# EAGLE schematic main (EAGLE 8.2.0)
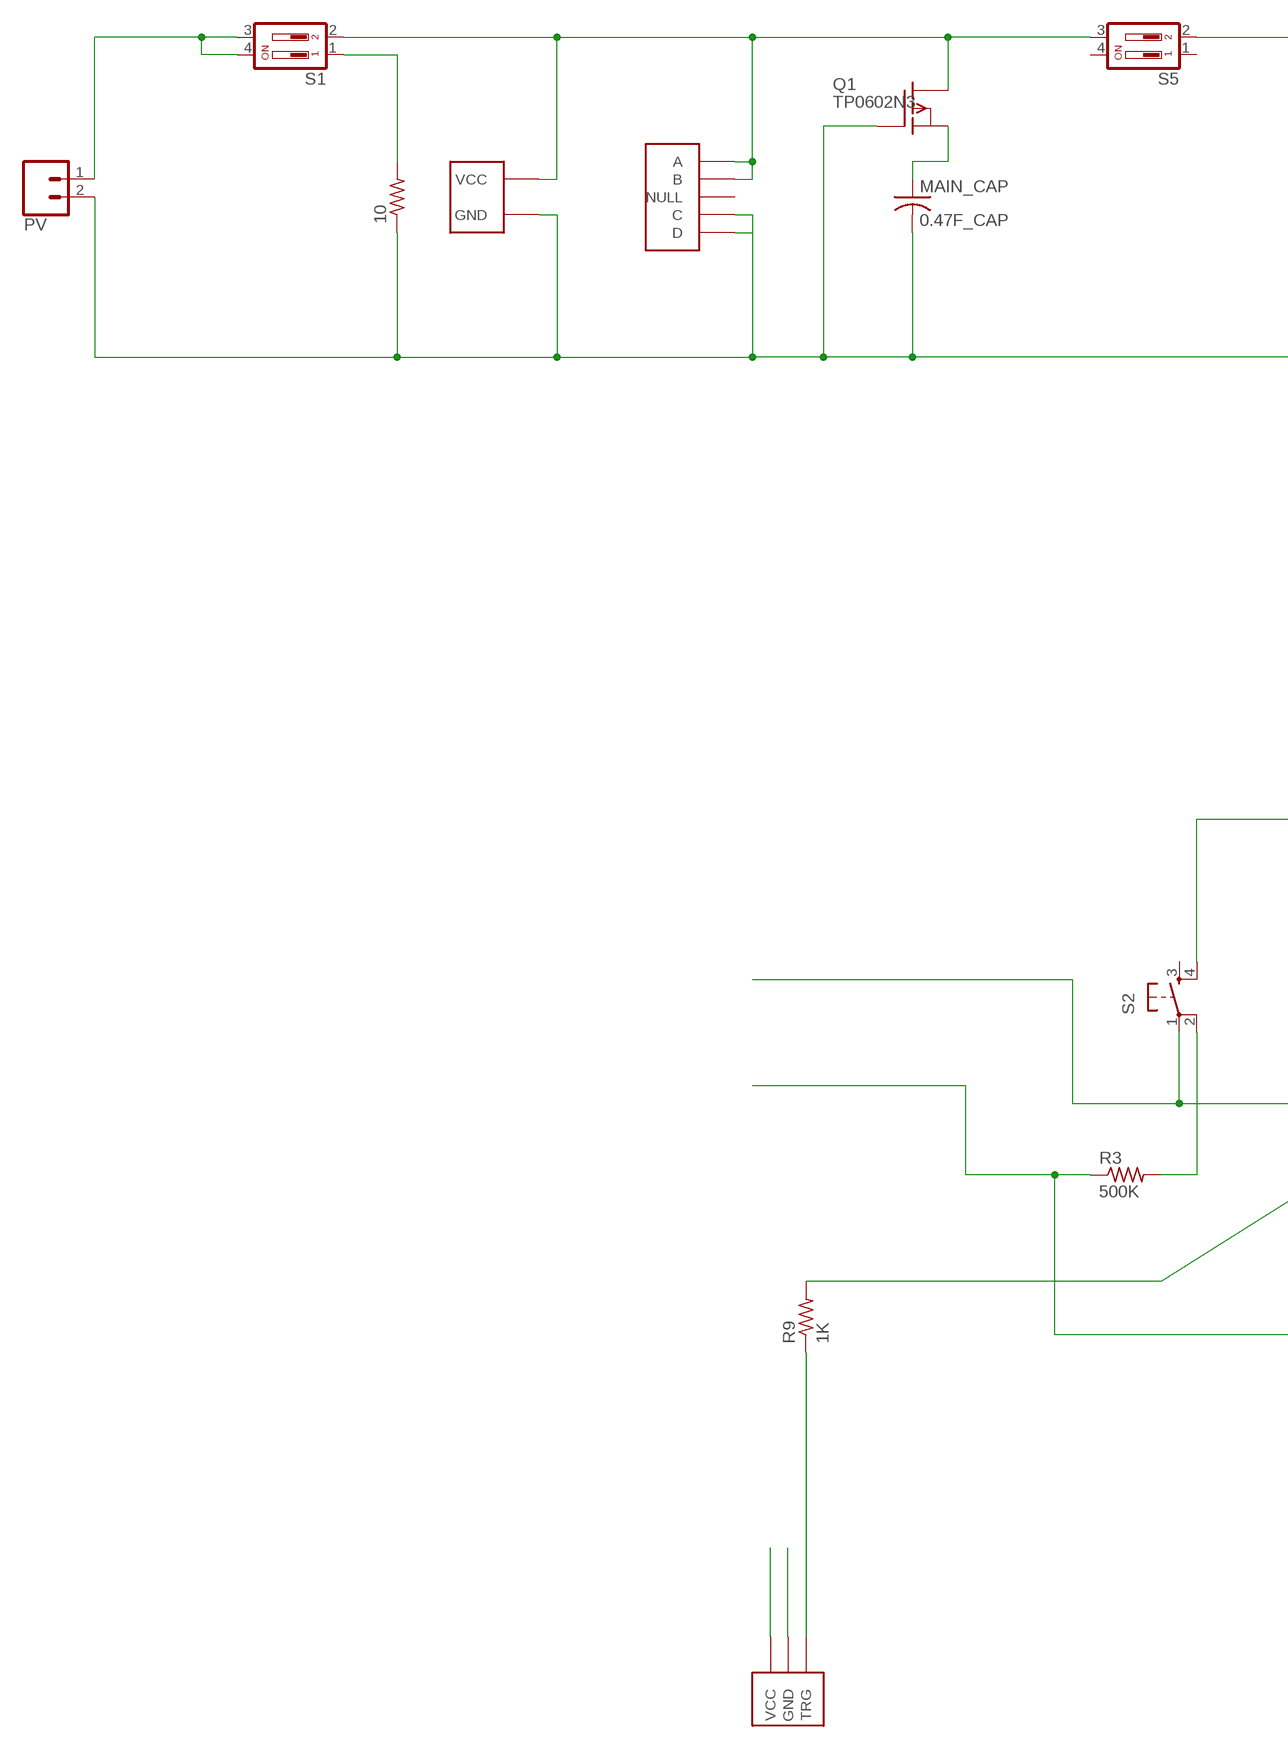
[diagram p0: schematic, sheet 1, part 1 of 2]
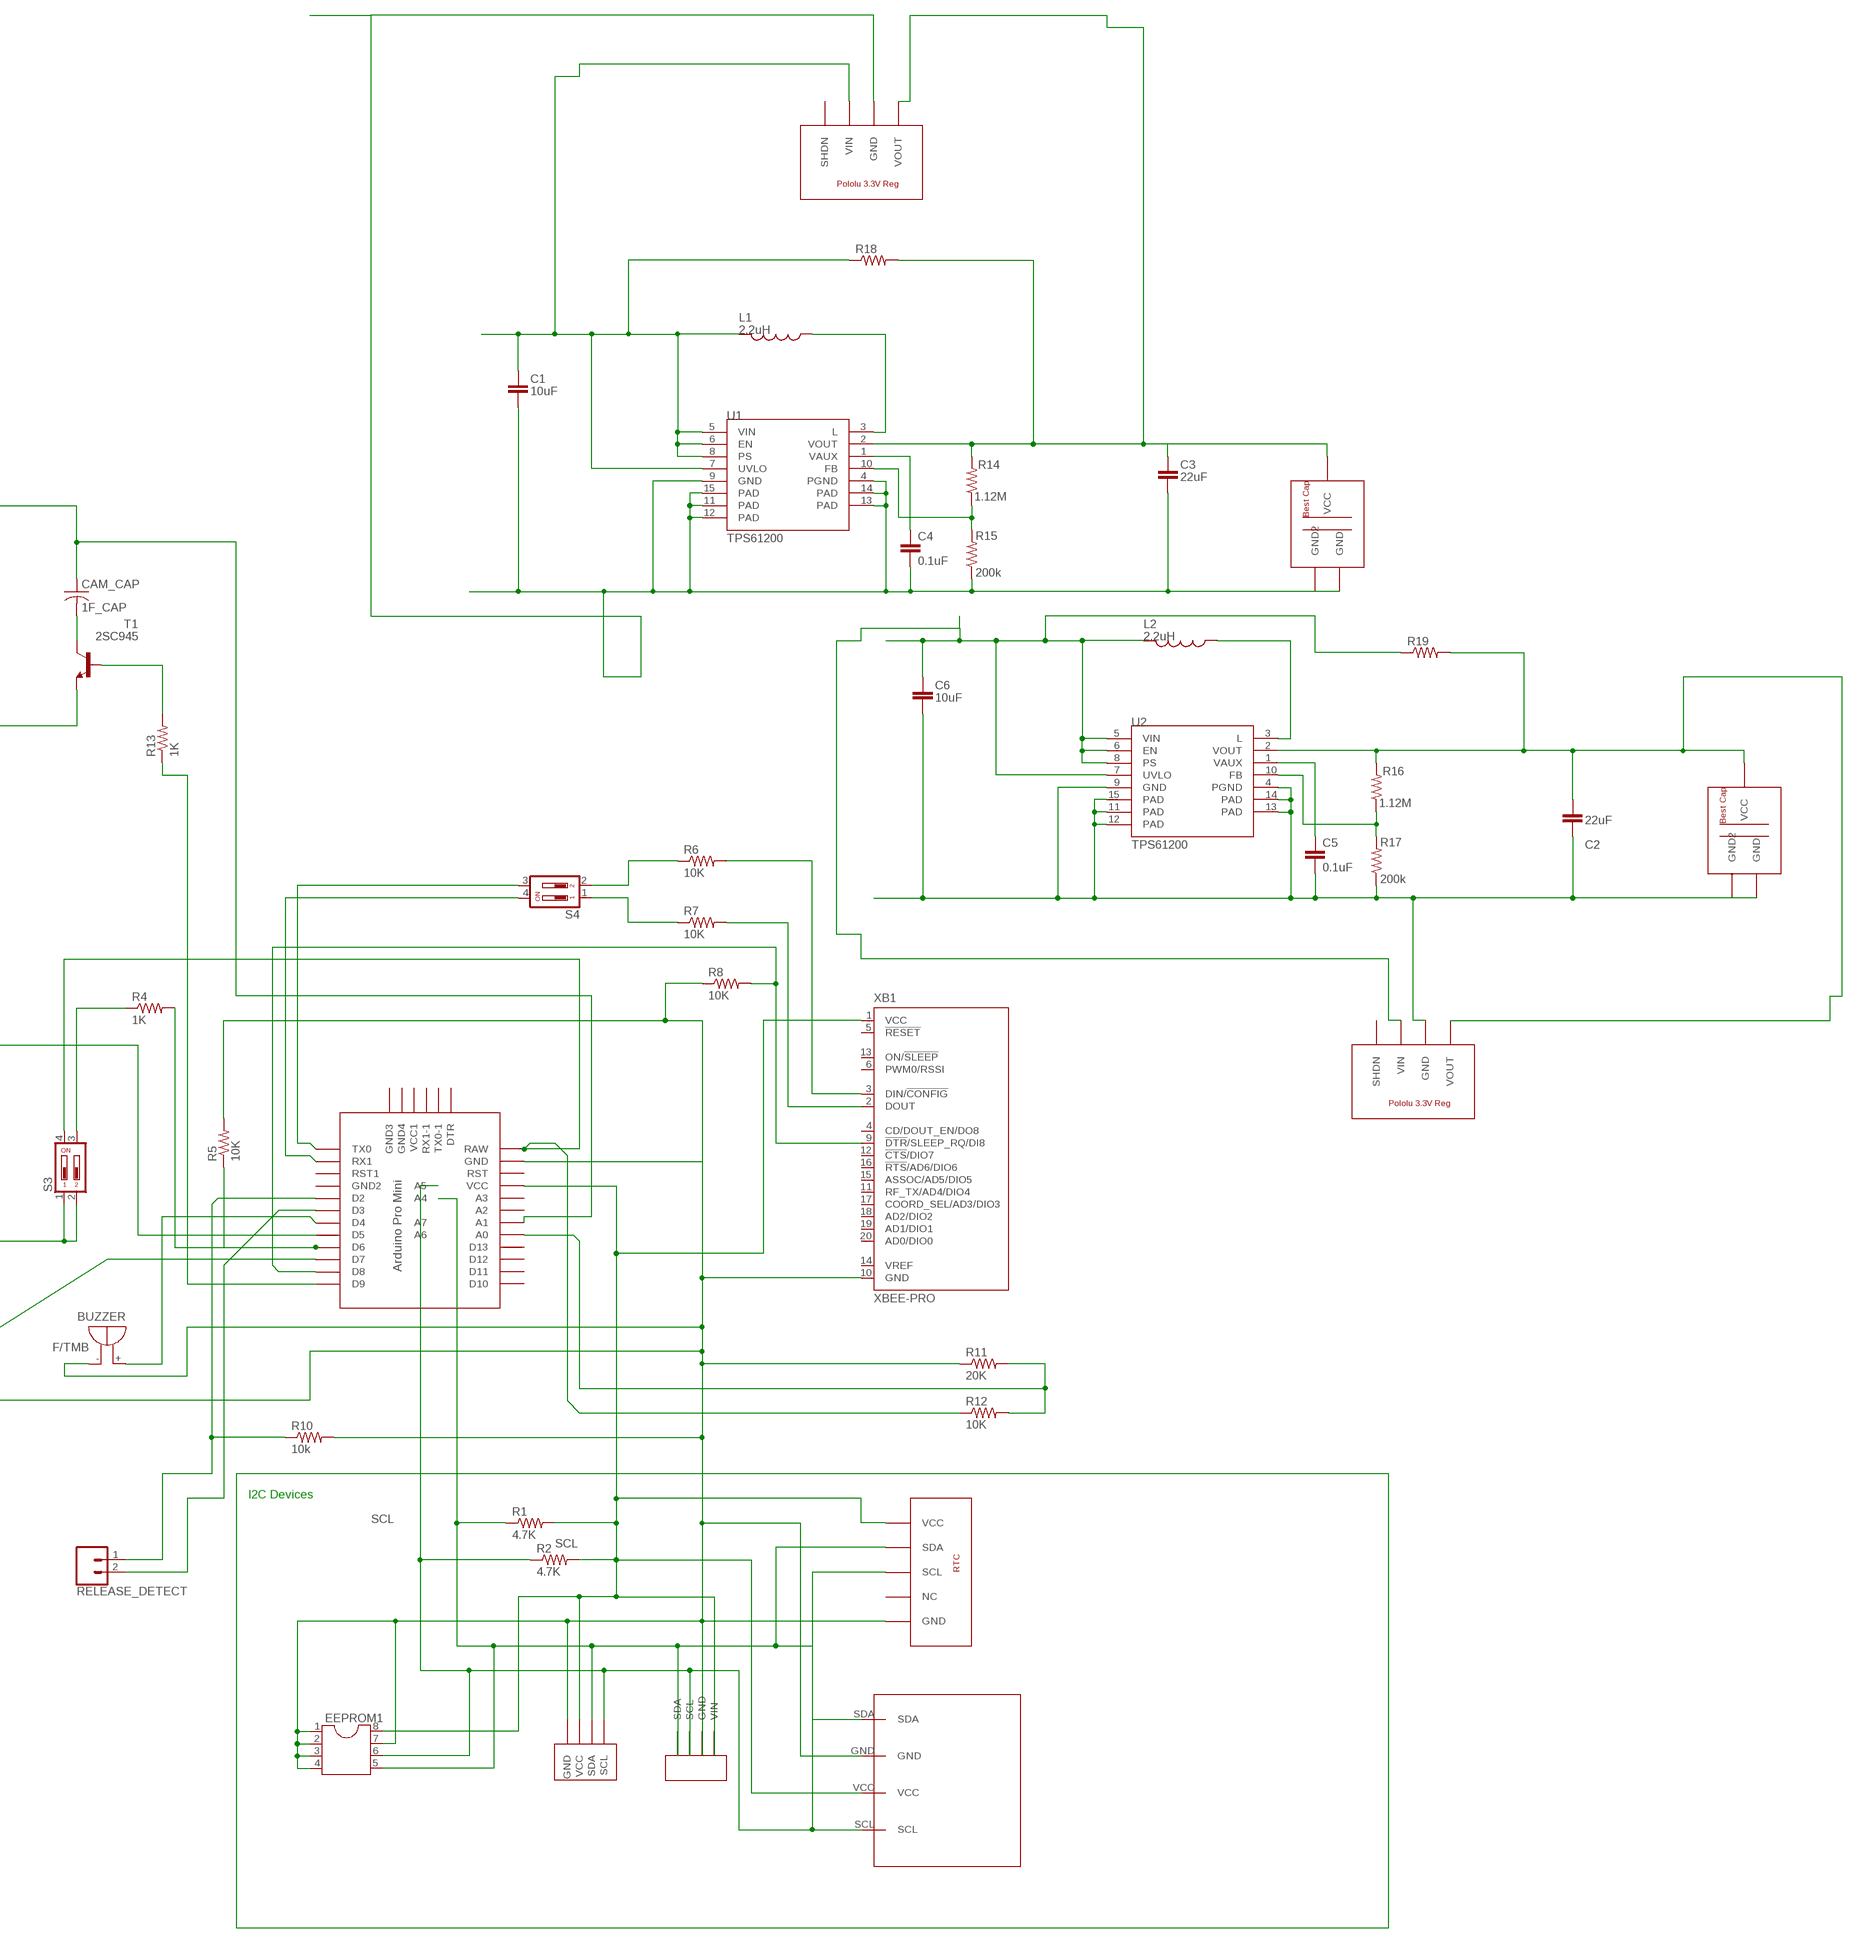
[diagram p1: schematic, sheet 1, part 2 of 2]

## Parts
10  R-US_M1206  [M1206]
BUZZER  F/TMB  [F/TMB]
C1  10uF  CAP0805  [0805]
C2  22uF  CAP0805  [0805]
C3  22uF  CAP0805  [0805]
C4  0.1uF  CAP0805  [0805]
C5  0.1uF  CAP0805  [0805]
C6  10uF  CAP0805  [0805]
CAM_CAP  1F_CAP  [1F_CAP]
EEPROM1  DIL8S  [SOCKET-08]
L1  2.2uH  INDUCTOR_LIP  [1212]
L2  2.2uH  INDUCTOR_LIP  [1212]
MAIN_CAP  0.47F_CAP  [0.47F_CAP]
PITOTTUBE  SENSIRION  [SENSIRIONSDP810]
PV  CONN_02  [1X02]
Q1  TP0602N3  [TO-92]
R1  4.7K  R-US_M0805  [M0805]
R2  4.7K  R-US_M0805  [M0805]
R3  500K  R-US_M0805  [M0805]
R4  1K  R-US_M0805  [M0805]
R5  10K  R-US_M0805  [M0805]
R6  10K  R-US_R0805  [R0805]
R7  10K  R-US_R0805  [R0805]
R8  10K  R-US_R0805  [R0805]
R9  1K  R-US_R0805  [R0805]
R10  10k  R-US_R0805  [R0805]
R11  20K  R-US_R0805  [R0805]
R12  10K  R-US_R0805  [R0805]
R13  1K  R-US_M0805  [M0805]
R14  1.12M  RESISTOR0805-RES  [0805]
R15  200k  RESISTOR0805-RES  [0805]
R16  1.12M  RESISTOR0805-RES  [0805]
R17  200k  RESISTOR0805-RES  [0805]
R18  R-US_M0805  [M0805]
R19  R-US_R0805  [R0805]
RELEASE_DETECT  CONN_02  [1X02]
S1  DP02  [DP-02]
S2  TAC_SWITCHPTH  [TACTILE-PTH]
S3  DP02  [DP-02]
S4  DP02  [DP-02]
S5  DP02  [DP-02]
T1  2SC945  [TO92-ECB]
U1  TPS61200  [QFN-10_PAD]
U2  TPS61200  [QFN-10_PAD]
U$1  PRO-MINI-2  [PRO-MINI-2]
U$2  HMC883L_BREAKOUT  [HMC5833L_BREAKOUT]
U$3  BMP180_BREAKOUT  [BMP180_BREAKOUT]
U$4  CAMERA_BREAKOUT  [CAMERA]
U$5  EXT_PWR  [EXTERNALPOWER]
U$6  VOLTMETER  [VOLTMETER]
U$7  RTC  [RTC]
U$8  BESTCAP  [BESTCAP]
U$9  BESTCAP  [BESTCAP]
U$10  POLOLU3VREG  [POLOLU3VREG]
U$11  POLOLU3VREG  [POLOLU3VREG]
XB1  XBEE-PRO  [XBEE-PRO]

## Nets
CAM_VIN: C2.1 R16.2 R19.2 U2.2(VOUT) U$4.VCC U$9.VCC U$11.VOUT
CAP_VIN: C6.1 CAM_CAP.+ L2.P$2 R19.1 S5.2 U2.5(VIN) U2.6(EN) U2.7(UVLO) U2.8(PS) U$1.A1 U$11.VIN
FB: R14.1 R15.2 U1.10(FB)
FB1: R16.1 R17.2 U2.10(FB)
GND: 10.1 BUZZER.- C1.2 C2.2 C3.2 C4.2 C5.2 C6.2 EEPROM1.1 EEPROM1.2 EEPROM1.3 EEPROM1.4 EEPROM1.7 MAIN_CAP.- PITOTTUBE.GND PV.2 Q1.2(G) R3.1 R5.2 R8.1 R10.2 R11.1 R15.1 R17.1 T1.E U1.4(PGND) U1.9(GND) U1.11(PAD) U1.12(PAD) U1.13(PAD) U1.14(PAD) U1.15(PAD) U2.4(PGND) U2.9(GND) U2.11(PAD) U2.12(PAD) U2.13(PAD) U2.14(PAD) U2.15(PAD) U$1.GND U$2.GND U$3.GND U$4.GND U$5.GND U$6.C U$6.D U$7.GND U$8.GND U$8.GND2 U$9.GND U$9.GND2 U$10.GND U$11.GND XB1.10(GND)
MAIN_VIN: C3.1 R14.2 R18.2 S2.1 S3.1 S3.2 U1.2(VOUT) U$8.VCC U$10.VOUT
N$4: L2.P$1 U2.3(L)
N$6: C5.1 U2.1(VAUX)
N$7: R3.2 S2.2
N$8: CAM_CAP.- T1.C
N$9: S2.4 U$1.D5
N$10: R12.1 S3.4 U$1.RAW
N$11: R4.1 S3.3
N$12: R4.2 R5.1 U$1.D6
N$15: R6.2 XB1.3(DIN/!CONFIG)
N$16: R6.1 S4.2
N$17: S4.3 U$1.TX0
N$18: R7.1 S4.1
N$19: R7.2 XB1.2(DOUT)
N$20: S4.4 U$1.RX1
N$21: R8.2 U$1.D8 XB1.9(!DTR!/SLEEP_RQ/DI8)
N$22: R9.2 U$1.D7
N$23: R9.1 U$4.TRG
N$24: BUZZER.+ U$1.D4
N$25: R10.1 RELEASE_DETECT.1 U$1.D2
N$26: RELEASE_DETECT.2 U$1.D3
N$27: R11.2 R12.2 U$1.A0
N$28: PV.1 S1.3 S1.4
N$29: 10.2 S1.1
N$30: R13.2 T1.B
N$31: R13.1 U$1.D9
N$32: L1.P$1 U1.3(L)
N$33: Q1.3(D) S1.2 S5.3 U$5.VCC U$6.A U$6.B
N$34: C4.1 U1.1(VAUX)
SCL: EEPROM1.6 PITOTTUBE.SCL R2.1 U$1.A5 U$2.SCL U$3.SCL U$7.SCL
SDA: EEPROM1.5 PITOTTUBE.SDA R1.1 U$1.A4 U$2.SDA U$3.SDA U$7.SDA
V33: EEPROM1.8 PITOTTUBE.VCC R1.2 R2.2 U$1.VCC U$2.VCC U$3.VIN U$7.VCC XB1.1(VCC)
VIN: C1.1 L1.P$2 MAIN_CAP.+ Q1.1(S) R18.1 U1.5(VIN) U1.6(EN) U1.7(UVLO) U1.8(PS) U$10.VIN
Unconnected: S2.3 S5.1 S5.4 U$1.A2 U$1.A3 U$1.A6 U$1.A7 U$1.D10 U$1.D11 U$1.D12 U$1.D13 U$1.DTR U$1.GND1(GND2) U$1.GND2(GND3) U$1.GND3(GND4) U$1.RST U$1.RST1 U$1.RX1-1 U$1.TX0-1 U$1.VCC1 U$6.NULL U$7.NC U$10.SHDN U$11.SHDN XB1.4(CD/DOUT_EN/DO8) XB1.5(!RESET) XB1.6(PWM0/RSSI) XB1.11(RF_TX/AD4/DIO4) XB1.12(!CTS!/DIO7) XB1.13(ON/!SLEEP) XB1.14(VREF) XB1.15(ASSOC/AD5/DIO5) XB1.16(!RTS!/AD6/DIO6) XB1.17(COORD_SEL/AD3/DIO3) XB1.18(AD2/DIO2) XB1.19(AD1/DIO1) XB1.20(AD0/DIO0)

## Notes on the sheet
- I2C Devices

## Library data of the parts
10 R1-R12 = rcl:R-US_: RESISTOR, American symbol
BUZZER = buzzer:F/TMB: BUZZER Source: Buerklin; OC_FARNELL: unknown; OC_NEWARK: unknown
C1-C3 C6 = CH_passive:CAP: Capacitor Standard 0603 ceramic capacitor, and 0.1" leaded capacitor.
C4 C5 = SparkFun:CAP: Capacitor Standard 0603 ceramic capacitor, and 0.1" leaded capacitor.
CAM_CAP = Capacitor105:1F_CAP
EEPROM1 = ic-package:DIL8: Dual In Line / Socket
L1 L2 = inductor_Lip:INDUCTOR_LIP
MAIN_CAP = Capacitor474:0.47F_CAP
PITOTTUBE = Sensirion:SENSIRION
PV RELEASE_DETECT = SparkFun-Connectors:CONN_02: Multi connection point. Often used as Generic Header-pin footprint for 0.1 inch spaced/style header connections On any of the 0.1 inch spaced packages, you can populate with these: Break Away Headers - Straight <https://www.sparkfun.com/products/116> (PRT-00116) Break Away Male Headers - Right Angle <https://www.sparkfun.com/products/553> (PRT-00553) Female Headers <https://www.sparkfun.com/products/115> (PRT-00115) Break Away Headers - Machine Pin <https://www.sparkfun.com/products/117> (PRT-00117) Break Away Female Headers - Swiss Machine Pin <https://www.sparkfun.com/products/743> (PRT-00743) For SCREWTERMINALS and SPRING TERMINALS visit here: Screw Terimnals on SparkFun.com <https://www.sparkfun.com/search/results?term=Screw+Terminals> (5mm/3.5mm/2.54mm spacing) This device is also useful as a general connection point to wire up your design to another part of your project. Our various solder wires solder well into these plated through hole pads. Hook-Up Wire - Assortment (Stranded, 22 AWG) <https://www.sparkfun.com/products/11375> (PRT-11375) Hook-Up Wire - Assortment (Solid Core, 22 AWG) <https://www.sparkfun.com/products/11367> (PRT-11367) View the entire wire category on our website here <https://www.sparkfun.com/categories/141> Special notes: Molex polarized connector foot print use with: PRT-08233 with associated crimp pins and housings. 2.54_SCREWTERM for use with PRT-10571. 3.5mm Screw Terminal footprints for PRT-08084 5mm Screw Terminal footprints for use with PRT-08432
Q1 = transistor-fet:TP0602N3: P-Channel Enhancement MOSFET -20V; -2A; 2,0Ohm
R13 R18 R19 = resistor:R-US_: RESISTOR, American symbol
R14-R17 = SparkFun:RESISTOR: Resistor Basic schematic elements and footprints for 0603, 1206, and PTH resistors.
S1 S3-S5 = switch-dil:DP02: DIL/CODE SWITCH; MPN: MCDP02; OC_FARNELL: 1255233; OC_NEWARK: 26M1095
S2 = SparkFun-Retired:TAC_SWITCH: Momentary Switch Button commonly used for reset or general input. Spark Fun Electronics SKU : COM-00097 SMT- SWCH-08247
T1 = transistor:2SC945: NPN Silicon Epitaxial Planar Transistor Source: SEMTECH ELECTRONICS LTD. ... 2SC945 2.pdf
U1 U2 = SparkFun:TPS61200: DC to DC Booster
U$1 = Arduino-clone:PRO-MINI-2: Arduino Pro Mini Layout 2 Sparkfun.com
U$2 = HMC883L_Breakout:HMC883L_BREAKOUT
U$3 = BMP180_Breakout:BMP180_BREAKOUT: BMP180 Breakout Board Model
U$4 = Camera:CAMERA_BREAKOUT
U$5 = EXT_PWR:EXT_PWR
U$6 = Voltmeter:VOLTMETER
U$7 = RTC:RTC
U$8 U$9 = BestCap:BESTCAP
U$10 U$11 = Polol3VReg:POLOLU3VREG
XB1 = maxstream:XBEE: XBee (TM) /XBee-PRO(TM) OEM RF Modules Source: MaxStream, Inc. xbee_productmanual.pdf; MPN: XBP24-AWI-001; OC_FARNELL: 1337916; OC_NEWARK: 42M2667